# EAGLE design Beaglebone CAN Cape (EAGLE 5.12)
BOM: EXCLUDE; DESC: BBB male header; PARTNO: RC0603JR-1010KL; VERSION: v2.3.1 - 2015-05-14

## Sheet 1 of 4
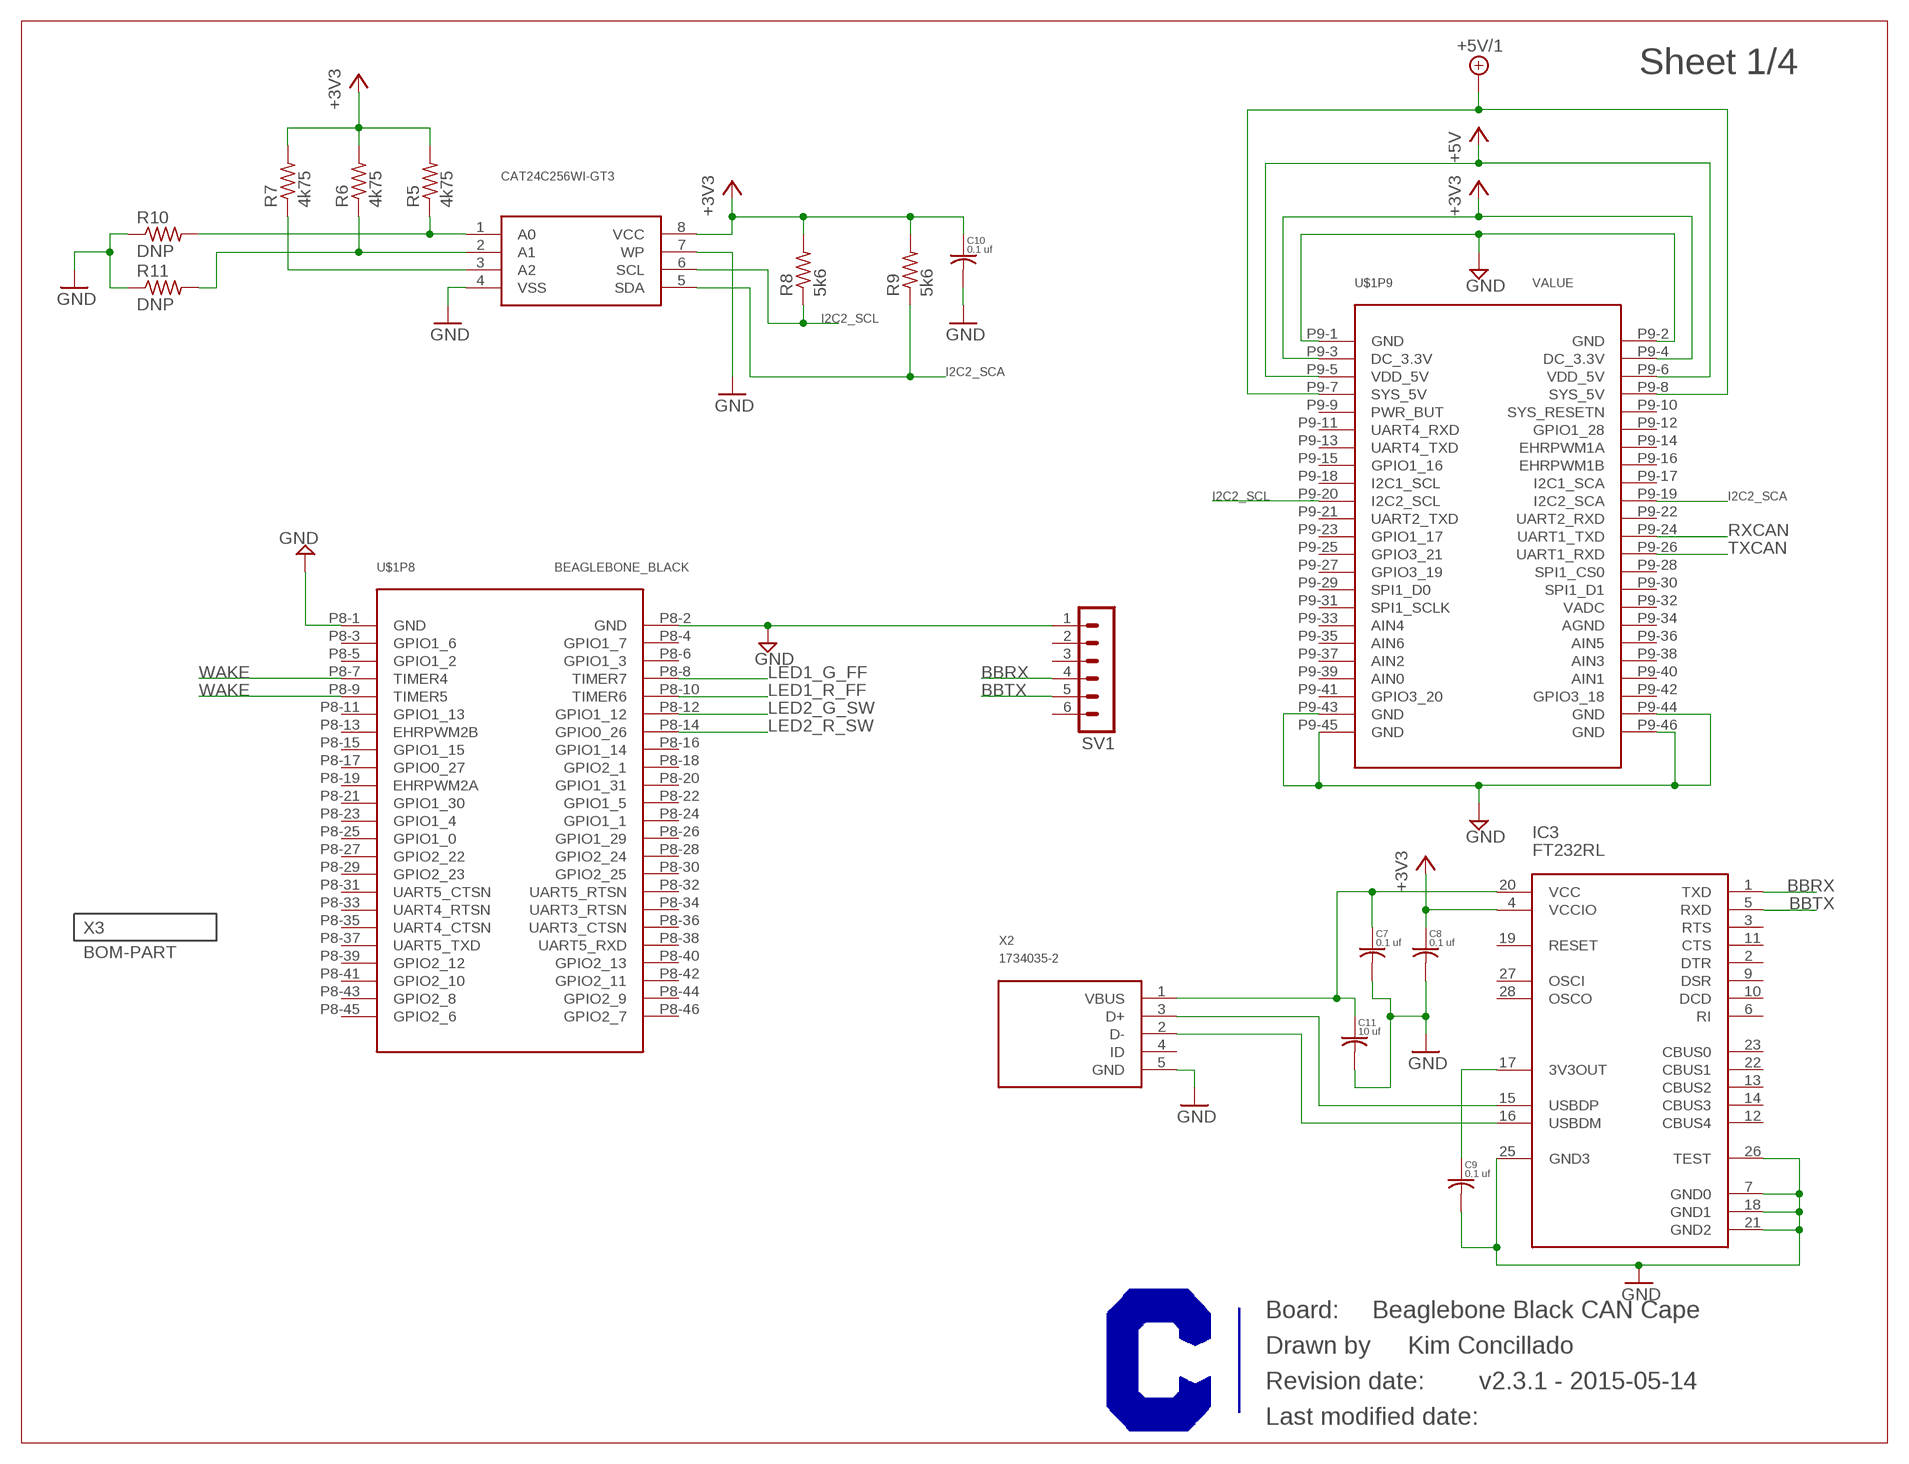
[diagram p0: schematic, sheet 1]
X3 (BOM-PART): BOM: INCLUDE; QTY: 1

### Parts
C7  0.1 uf  C-USC0603  [C0603]
C8  0.1 uf  C-USC0603  [C0603]
C9  0.1 uf  C-USC0603  [C0603]
C10  0.1 uf  C-USC0603  [C0603]
C11  10 uf  C-USC0805  [C0805]
CAT24C256WI-GT3  CAT24C256WI-GT3OSCT-ND  [CAT24C256WI-GT3]
IC3  FT232RL  [SSOP-28]
R5  4k75  R-US_R0603  [R0603]
R6  4k75  R-US_R0603  [R0603]
R7  4k75  R-US_R0603  [R0603]
R8  5k6  R-US_R0603  [R0603]
R9  5k6  R-US_R0603  [R0603]
R10  DNP  R-US_R0603  [R0603]
R11  DNP  R-US_R0603  [R0603]
SV1  MA06-1  [MA06-1]
U$1  BEAGLEBONE_BLACK  [BEAGLEBONEBLACK]
U$2  CURRENT-C-LETTER-LANDSCAPE  [BLANK]
X2  1734035-2  [1734035-2]

### Nets
+3V3: C8.1 C10.1 CAT24C256WI-GT3.8(VCC) IC3.4(VCCIO) R5.2 R6.2 R7.2 R8.2 R9.2 U$1.P9-3(P9:DC_3.3V) U$1.P9-4(P9:DC_3.3V) ; also sheet 2
+5V: U$1.P9-5(P9:VDD_5V) U$1.P9-6(P9:VDD_5V) ; also sheet 2,3
+5V/1: U$1.P9-7(P9:SYS_5V) U$1.P9-8(P9:SYS_5V)
BBRX: IC3.1(TXD) SV1.4
BBTX: IC3.5(RXD) SV1.5
GND: C7.2 C8.2 C9.2 C10.2 C11.2 CAT24C256WI-GT3.4(VSS) CAT24C256WI-GT3.7(WP) IC3.7(GND0) IC3.18(GND1) IC3.21(GND2) IC3.25(GND3) IC3.26(TEST) R10.1 R11.1 SV1.1 U$1.P8-1(P8:GND) U$1.P8-2(P8:GND) U$1.P9-1(P9:GND) U$1.P9-2(P9:GND) U$1.P9-43(P9:GND) U$1.P9-44(P9:GND) U$1.P9-45(P9:GND) U$1.P9-46(P9:GND) X2.5(GND) ; also sheet 2,3,4
I2C2_SCA: CAT24C256WI-GT3.5(SDA) R9.1 U$1.P9-19(P9:I2C2_SCA)
I2C2_SCL: CAT24C256WI-GT3.6(SCL) R8.1 U$1.P9-20(P9:I2C2_SCL)
LED1_G_FF: U$1.P8-8(P8:TIMER7) ; also sheet 4
LED1_R_FF: U$1.P8-10(P8:TIMER6) ; also sheet 4
LED2_G_SW: U$1.P8-12(P8:GPIO1_12) ; also sheet 4
LED2_R_SW: U$1.P8-14(P8:GPIO0_26) ; also sheet 4
N$11: C7.1 C11.1 IC3.20(VCC) X2.1(VBUS)
N$12: CAT24C256WI-GT3.2(A1) R6.1 R11.2
N$13: IC3.15(USBDP) X2.3(D+)
N$14: IC3.16(USBDM) X2.2(D-)
N$15: C9.1 IC3.17(3V3OUT)
N$16: CAT24C256WI-GT3.1(A0) R5.1 R10.2
N$17: CAT24C256WI-GT3.3(A2) R7.1
RXCAN: U$1.P9-24(P9:UART1_TXD) ; also sheet 3
TXCAN: U$1.P9-26(P9:UART1_RXD) ; also sheet 3
WAKE: U$1.P8-7(P8:TIMER4) U$1.P8-9(P8:TIMER5) ; also sheet 4
Unconnected: IC3.2(DTR) IC3.3(RTS) IC3.6(RI) IC3.9(DSR) IC3.10(DCD) IC3.11(CTS) IC3.12(CBUS4) IC3.13(CBUS2) IC3.14(CBUS3) IC3.19(RESET) IC3.22(CBUS1) IC3.23(CBUS0) IC3.27(OSCI) IC3.28(OSCO) SV1.2 SV1.3 SV1.6 U$1.P8-3(P8:GPIO1_6) U$1.P8-4(P8:GPIO1_7) U$1.P8-5(P8:GPIO1_2) U$1.P8-6(P8:GPIO1_3) U$1.P8-11(P8:GPIO1_13) U$1.P8-13(P8:EHRPWM2B) U$1.P8-15(P8:GPIO1_15) U$1.P8-16(P8:GPIO1_14) U$1.P8-17(P8:GPIO0_27) U$1.P8-18(P8:GPIO2_1) U$1.P8-19(P8:EHRPWM2A) U$1.P8-20(P8:GPIO1_31) U$1.P8-21(P8:GPIO1_30) U$1.P8-22(P8:GPIO1_5) U$1.P8-23(P8:GPIO1_4) U$1.P8-24(P8:GPIO1_1) U$1.P8-25(P8:GPIO1_0) U$1.P8-26(P8:GPIO1_29) U$1.P8-27(P8:GPIO2_22) U$1.P8-28(P8:GPIO2_24) U$1.P8-29(P8:GPIO2_23) U$1.P8-30(P8:GPIO2_25) U$1.P8-31(P8:UART5_CTSN) U$1.P8-32(P8:UART5_RTSN) U$1.P8-33(P8:UART4_RTSN) U$1.P8-34(P8:UART3_RTSN) U$1.P8-35(P8:UART4_CTSN) U$1.P8-36(P8:UART3_CTSN) U$1.P8-37(P8:UART5_TXD) U$1.P8-38(P8:UART5_RXD) U$1.P8-39(P8:GPIO2_12) U$1.P8-40(P8:GPIO2_13) U$1.P8-41(P8:GPIO2_10) U$1.P8-42(P8:GPIO2_11) U$1.P8-43(P8:GPIO2_8) U$1.P8-44(P8:GPIO2_9) U$1.P8-45(P8:GPIO2_6) U$1.P8-46(P8:GPIO2_7) U$1.P9-9(P9:PWR_BUT) U$1.P9-10(P9:SYS_RESETN) U$1.P9-11(P9:UART4_RXD) U$1.P9-12(P9:GPIO1_28) U$1.P9-13(P9:UART4_TXD) U$1.P9-14(P9:EHRPWM1A) U$1.P9-15(P9:GPIO1_16) U$1.P9-16(P9:EHRPWM1B) U$1.P9-17(P9:I2C1_SCA) U$1.P9-18(P9:I2C1_SCL) U$1.P9-21(P9:UART2_TXD) U$1.P9-22(P9:UART2_RXD) U$1.P9-23(P9:GPIO1_17) U$1.P9-25(P9:GPIO3_21) U$1.P9-27(P9:GPIO3_19) U$1.P9-28(P9:SPI1_CS0) U$1.P9-29(P9:SPI1_D0) U$1.P9-30(P9:SPI1_D1) U$1.P9-31(P9:SPI1_SCLK) U$1.P9-32(P9:VADC) U$1.P9-33(P9:AIN4) U$1.P9-34(P9:AGND) U$1.P9-35(P9:AIN6) U$1.P9-36(P9:AIN5) U$1.P9-37(P9:AIN2) U$1.P9-38(P9:AIN3) U$1.P9-39(P9:AIN0) U$1.P9-40(P9:AIN1) U$1.P9-41(P9:GPIO3_20) U$1.P9-42(P9:GPIO3_18) X2.4(ID)

### Notes on the sheet
- Beaglebone Black CAN Cape
- Kim Concillado

## Sheet 2 of 4
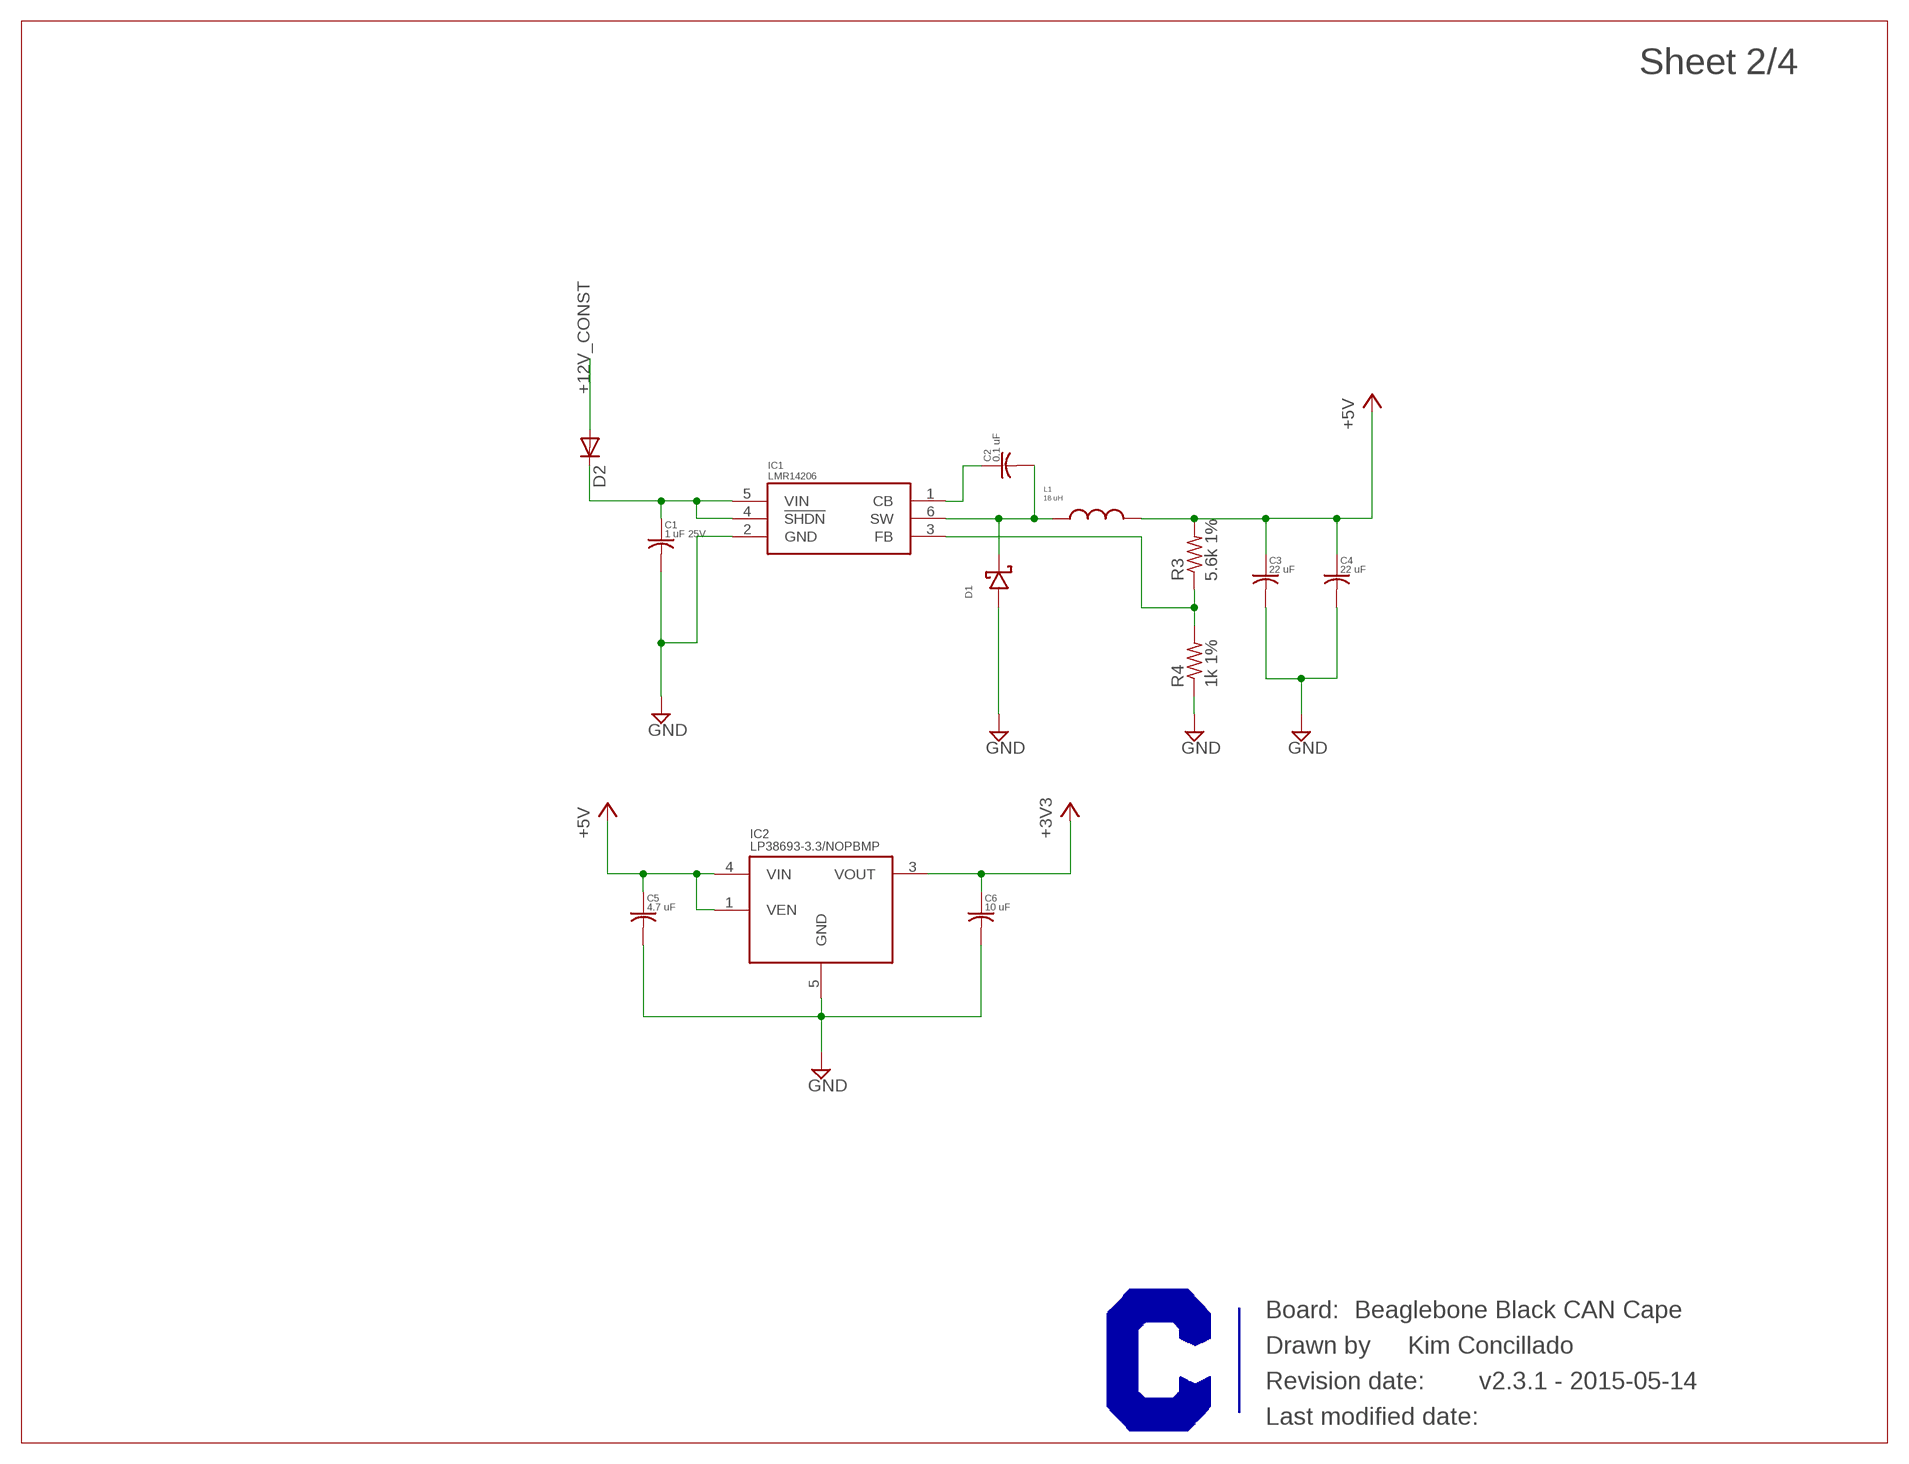
[diagram p1: schematic, sheet 2]

### Parts
C1  1 uF 25V  C-USC1206  [C1206]
C2  0.1 uF  C-USC0603  [C0603]
C3  22 uF  C-USC0805  [C0805]
C4  22 uF  C-USC0805  [C0805]
C5  4.7 uF  C-USC1206  [C1206]
C6  10 uF  C-USC1206  [C1206]
D1  SCHOTTKY_DIODE-SMA  [SMA]
D2  DIODE-SOD123  [SOD123]
IC1  LMR14206  [SOT-6_DDC]
IC2  LP38693-3.3/NOPBMP  [SOT-223-5]
L1  18 uH  VLP8040T  [VLP8040]
R3  5.6k 1%  R-US_R0603  [R0603]
R4  1k 1%  R-US_R0603  [R0603]
U$3  CURRENT-C-LETTER-LANDSCAPE  [BLANK]

### Nets
+3V3: C6.1 IC2.3(VOUT) ; also sheet 1
+5V: C3.1 C4.1 C5.1 IC2.1(VEN) IC2.4(VIN) L1.2 R3.2 ; also sheet 1,3
+12V_CONST: D2.A ; also sheet 4
GND: C1.2 C3.2 C4.2 C5.2 C6.2 D1.ANODE IC1.2(GND) IC2.5(GND) R4.1 ; also sheet 1,3,4
N$1: C1.1 D2.C IC1.4(!SHDN) IC1.5(VIN)
N$5: C2.1 IC1.1(CB)
N$6: C2.2 D1.CATHODE IC1.6(SW) L1.1
N$7: IC1.3(FB) R3.1 R4.2

### Notes on the sheet
- Beaglebone Black CAN Cape
- Kim Concillado

## Sheet 3 of 4
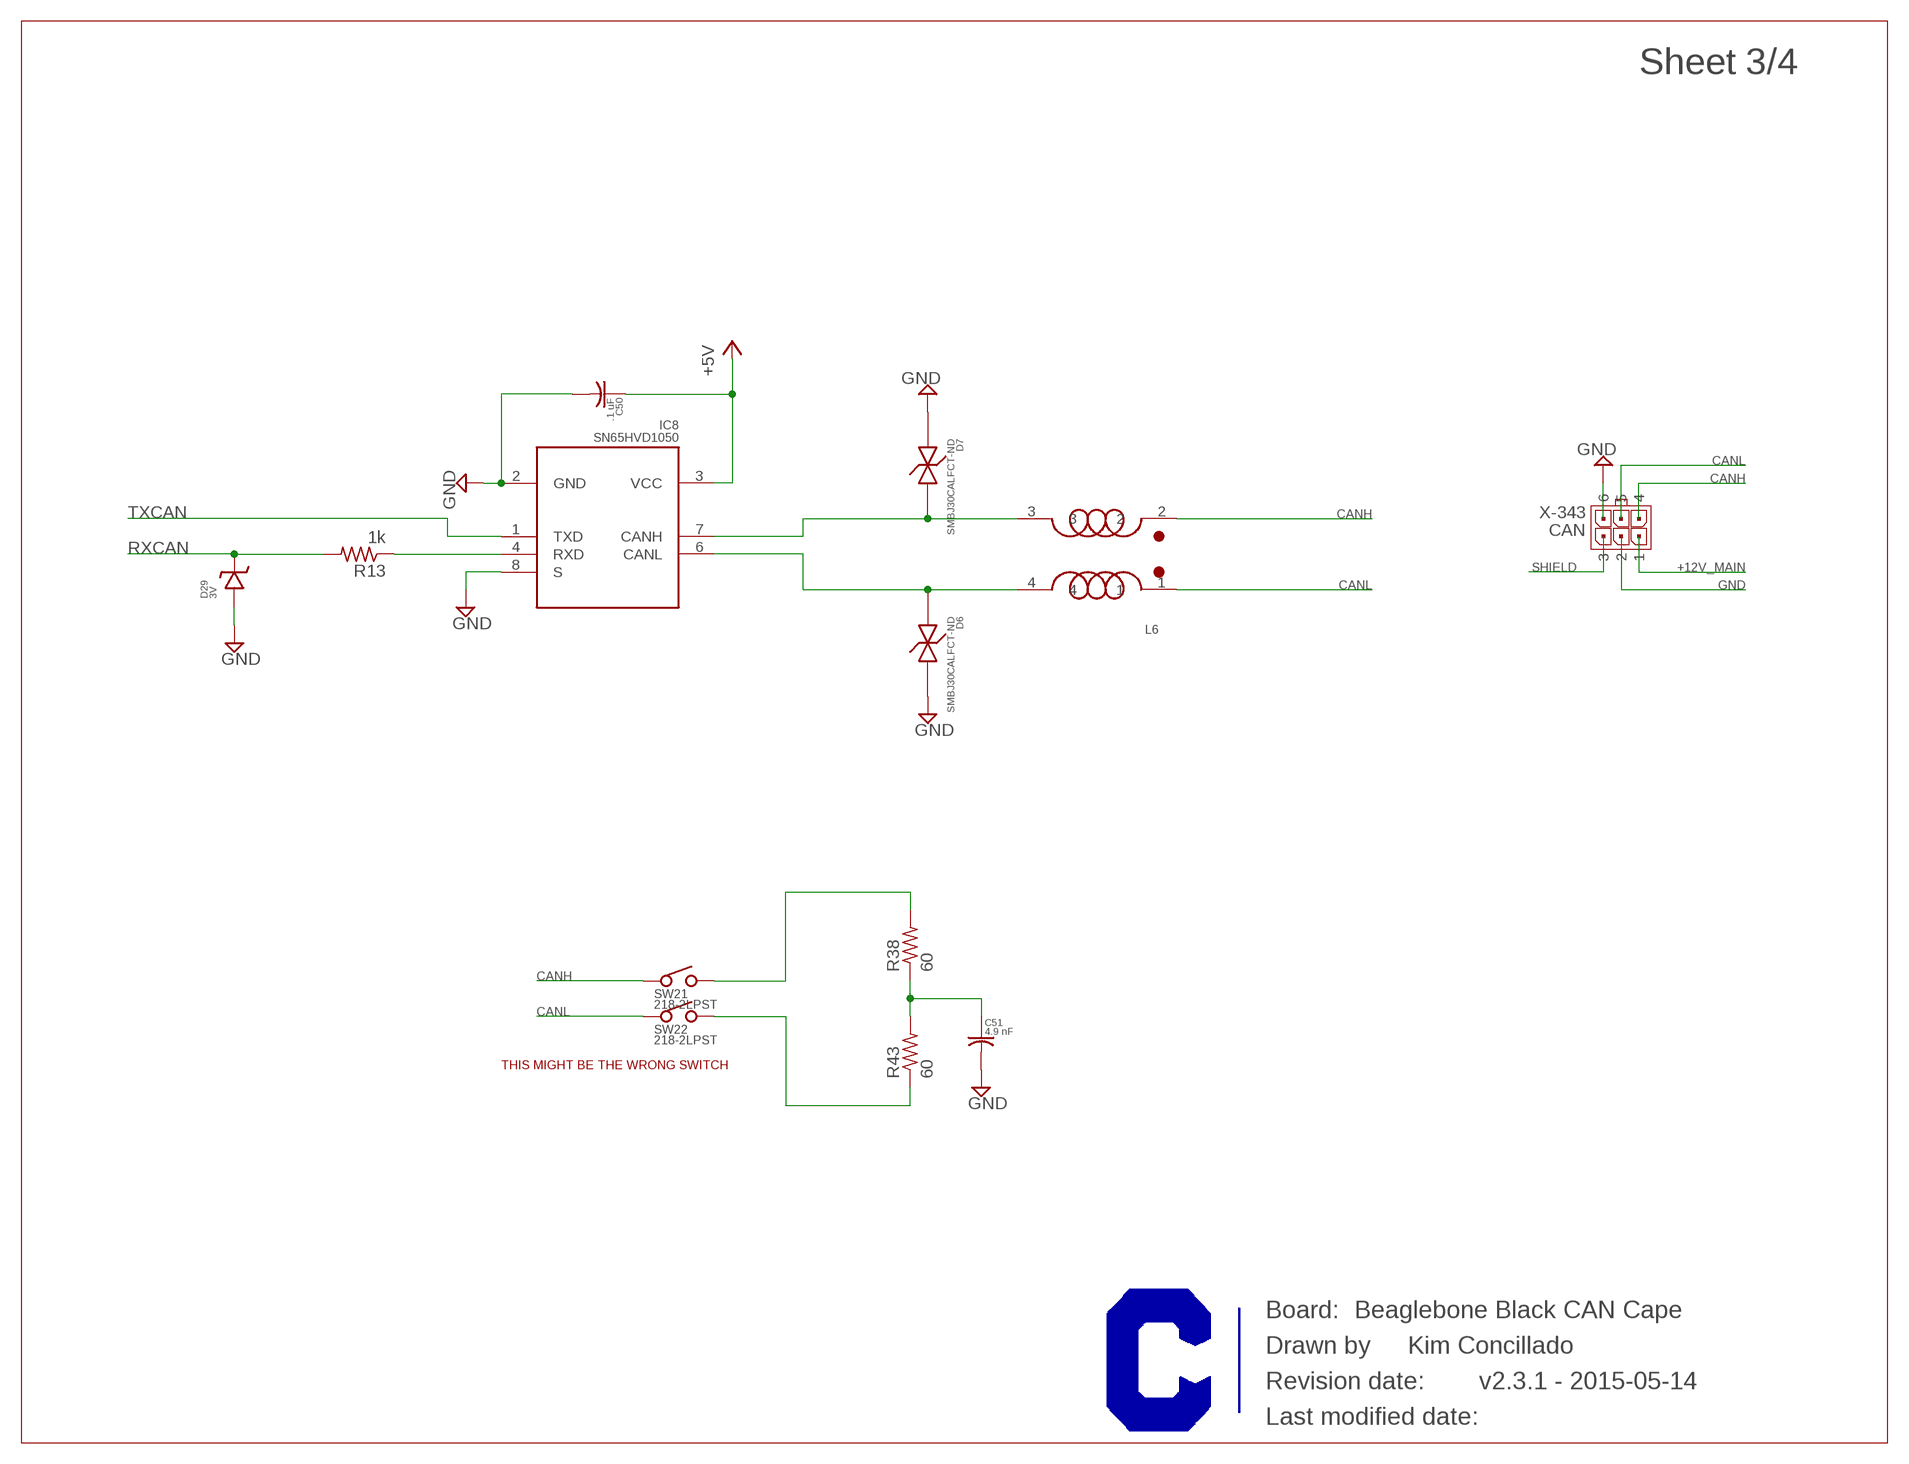
[diagram p2: schematic, sheet 3]

### Parts
C50  .1 uF  C-USC0603  [C0603]
C51  4.9 nF  C-USC0603  [C0603]
D6  SMBJ30CALFCT-ND  SMBJ30CA  [DO-214AA]
D7  SMBJ30CALFCT-ND  SMBJ30CA  [DO-214AA]
D29  3V  ZENER_DIODE-SOD-323  [SOD-323]
IC8  SN65HVD1050  [D_(R-PDSO-G8)]
L6  DR331-513AE  [SMD]
R13  1k  R-US_R0603  [R0603]
R38  60  R-US_R0603  [R0603]
R43  60  R-US_R0603  [R0603]
SW2  218-2LPST  218-2_GULLWING  [218-2_GULLWING]
U$4  CURRENT-C-LETTER-LANDSCAPE  [BLANK]
X-343  CAN  MICROFIT-06-DUAL-RA-SMD  [MICROFIT-6-DUAL-RA-SMD]

### Nets
+5V: C50.1 IC8.3(VCC) ; also sheet 1,2
+12V_MAIN: X-343.1 ; also sheet 4
CANH: L6.2 SW2.1A X-343.4
CANL: L6.1 SW2.2A X-343.5
GND: C50.2 C51.2 D6.2 D7.1 D29.ANODE IC8.2(GND) IC8.8(S) X-343.2 X-343.6 ; also sheet 1,2,4
N$19: D7.2 IC8.7(CANH) L6.3
N$22: D6.1 IC8.6(CANL) L6.4
N$39: R38.2 SW2.1B
N$40: R43.1 SW2.2B
N$41: C51.1 R38.1 R43.2
N$56: IC8.4(RXD) R13.1
RXCAN: D29.CATHODE R13.2 ; also sheet 1
SHIELD: X-343.3
TXCAN: IC8.1(TXD) ; also sheet 1

### Notes on the sheet
- SHIELD
- THIS MIGHT BE THE WRONG SWITCH
- Beaglebone Black CAN Cape
- Kim Concillado

## Sheet 4 of 4
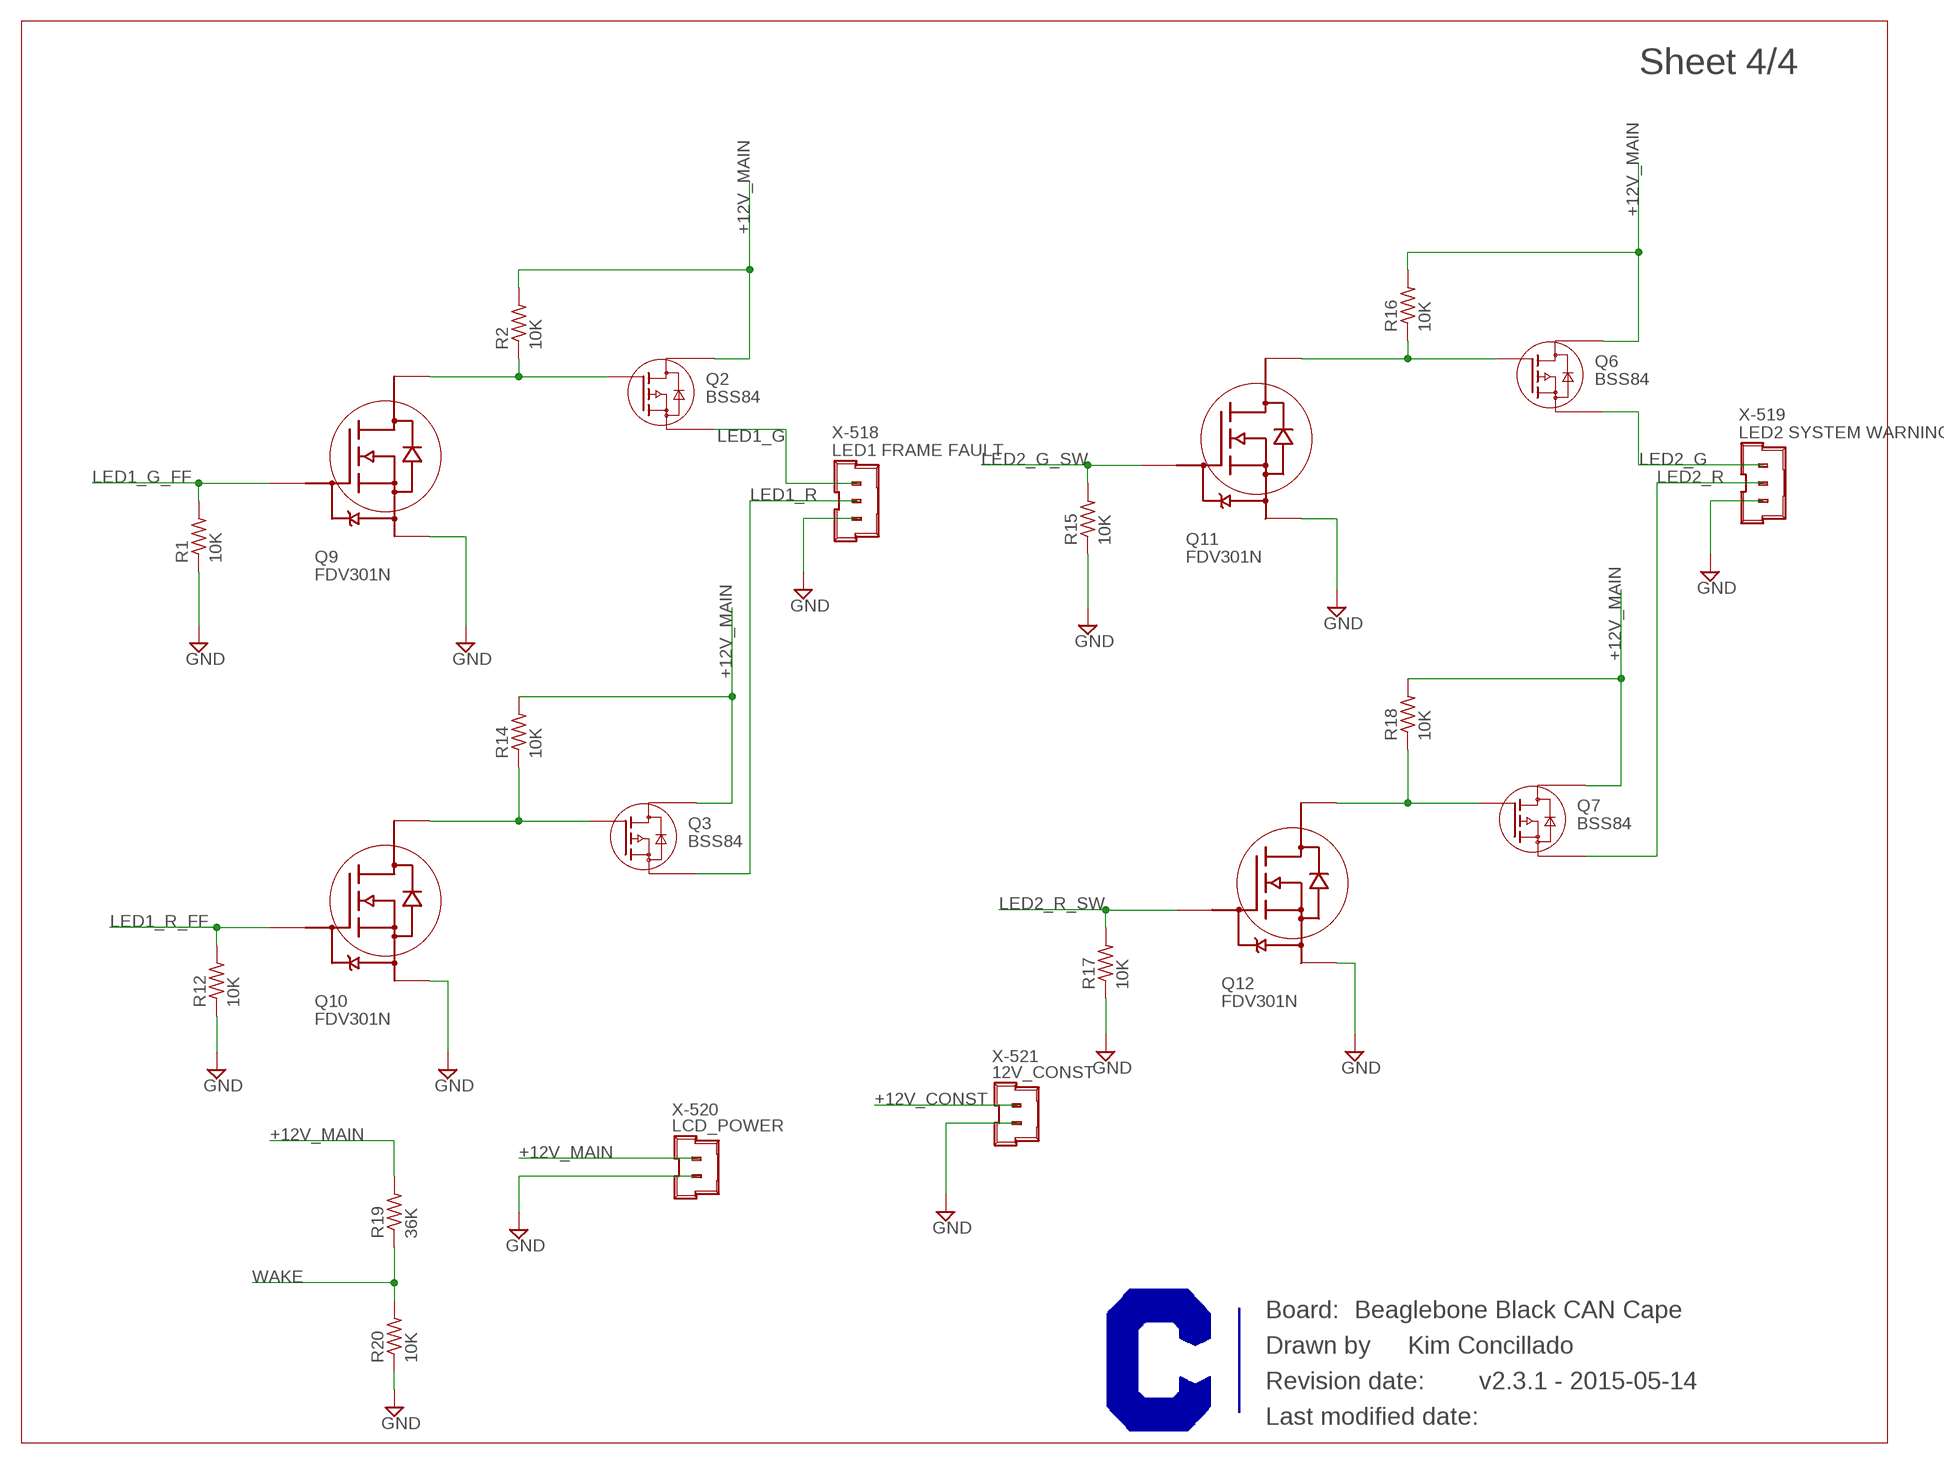
[diagram p3: schematic, sheet 4]

### Parts
Q2  BSS84  [SOT-23]
Q3  BSS84  [SOT-23]
Q6  BSS84  [SOT-23]
Q7  BSS84  [SOT-23]
Q9  FDV301N  [SOT-23]
Q10  FDV301N  [SOT-23]
Q11  FDV301N  [SOT-23]
Q12  FDV301N  [SOT-23]
R1  10K  R-US_R0603  [R0603]
R2  10K  R-US_R0603  [R0603]
R12  10K  R-US_R0603  [R0603]
R14  10K  R-US_R0603  [R0603]
R15  10K  R-US_R0603  [R0603]
R16  10K  R-US_R0603  [R0603]
R17  10K  R-US_R0603  [R0603]
R18  10K  R-US_R0603  [R0603]
R19  36K  R-US_R0603  [R0603]
R20  10K  R-US_R0603  [R0603]
U$6  CURRENT-C-LETTER-LANDSCAPE  [BLANK]
X-518  LED1 FRAME FAULT  DURACLIK-03-HDR-VERT  [DURACLIK-3-VERT]
X-519  LED2 SYSTEM WARNING  DURACLIK-03-HDR-VERT  [DURACLIK-3-VERT]
X-520  LCD_POWER  DURACLIK-02-HDR-VERT  [DURACLIK-2-VERT]
X-521  12V_CONST  DURACLIK-02-HDR-VERT  [DURACLIK-2-VERT]

### Nets
+12V_CONST: X-521.2 ; also sheet 2
+12V_MAIN: Q2.2(SOURCE) Q3.2(SOURCE) Q6.2(SOURCE) Q7.2(SOURCE) R2.2 R14.2 R16.2 R18.2 R19.2 X-520.2 ; also sheet 3
GND: Q9.2(SOURCE) Q10.2(SOURCE) Q11.2(SOURCE) Q12.2(SOURCE) R1.1 R12.1 R15.1 R17.1 R20.1 X-518.1 X-519.1 X-520.1 X-521.1 ; also sheet 1,2,3
LED1_G: Q2.3(DRAIN) X-518.3
LED1_G_FF: Q9.1(GATE) R1.2 ; also sheet 1
LED1_R: Q3.3(DRAIN) X-518.2
LED1_R_FF: Q10.1(GATE) R12.2 ; also sheet 1
LED2_G: Q6.3(DRAIN) X-519.3
LED2_G_SW: Q11.1(GATE) R15.2 ; also sheet 1
LED2_R: Q7.3(DRAIN) X-519.2
LED2_R_SW: Q12.1(GATE) R17.2 ; also sheet 1
N$4: Q2.1(GATE) Q9.3(DRAIN) R2.1
N$8: Q6.1(GATE) Q11.3(DRAIN) R16.1
N$18: Q7.1(GATE) Q12.3(DRAIN) R18.1
N$21: Q3.1(GATE) Q10.3(DRAIN) R14.1
WAKE: R19.1 R20.2 ; also sheet 1

### Notes on the sheet
- Beaglebone Black CAN Cape
- Kim Concillado

## Library data of the parts
C1-C11 C50 C51 = rcl:C-US: CAPACITOR, American symbol
CAT24C256WI-GT3 = ON Semiconductor:CAT24C256WI-GT3OSCT-ND: http://www.skyworksinc.com/uploads/documents/200123K.pdf; PARTNO: CAT24C256WI-GT3
D1 = Diodes:SCHOTTKY_DIODE
D2 = diode:DIODE-: DIODE
D6 D7 = Littelfuse:SMBJ30CA: Bidirectional TVS Zener Diode 30V Breakdown http://www.digikey.com/product-detail/en/SMBJ30CA/SMBJ30CALFCT-ND/286112; PARTNO: SMBJ30CALFCT-ND
D29 = Diodes:ZENER_DIODE
IC1 = TI:LMR14206: LMR14206 SIMPLE SWITCHER® 42Vin, 0.6A Step-Down Voltage Regulator in SOT-23 Datasheet: http://www.ti.com/lit/ds/symlink/lmr14206.pdf
IC2 = TI:LP38693: TI LP38693-3.3 LDO 500mA Very Low Vdo. http://www.ti.com/lit/ds/symlink/lp38693.pdf; PARTNO: LP38693MP-3.3/NOPB
IC3 = FTDI:FT232RL: http://datasheet.octopart.com/FT232RL-FTDI-datasheet-120501.pdf; PARTNO: FT232RL
IC8 = TI:SN65HVD1050: SN65HVD1050 - EMC Optimized CAN Transceiever Datasheet: http://www.ti.com/lit/ds/symlink/sn65hvd1050.pdf; PARTNO: SN65HVD1050D
L1 = TDK:VLP: VLP Series Shielded Wound Ferrite Inductors Datasheet: http://datasheet.octopart.com/VLP8040T-100M-TDK-datasheet-16646286.pdf
L6 = Bourns:DR331-513AE: Bourns Common Mode Choke; PARTNO: DR331-513AECT-ND
Q2 Q3 Q6 Q7 = Fairchild Semiconductor:BSS84: P-Channel Enhancement Mode Field-Effect Transistor, -0.13 A, -50 V, SOT-23 Datasheet: http://datasheet.octopart.com/BSS84-Fairchild-Semiconductor-datasheet-15983362.pdf; PARTNO: BSS84
Q9-Q12 = Fairchild Semiconductor:FDV301N: FDV301N: Digital FET, N-Channel, 25V, 0.22 A continuous Datasheet: http://www.fairchildsemi.com/ds/FD/FDV301N.pdf; PARTNO: FDV301N
R1-R20 R38 R43 = rcl:R-US_: RESISTOR, American symbol
SV1 = con-lstb:MA06-1: PIN HEADER; OC_FARNELL: unknown; OC_NEWARK: unknown
SW2 = CTS:218-2: CTS 218-2: 0.05" pitch DIP switch, SPST, 2 positions; PARTNO: 218-2LPST
U$1 = TI:BEAGLEBONE_BLACK
U$2-U$4 U$6 = Frames:CURRENT-C-LETTER-LANDSCAPE; BOM: EXCLUDE
X2 = TE:1734035-2: http://datasheet.octopart.com/1734035-2-TE-Connectivity-datasheet-11087025.pdf; PARTNO: 1734035-2
X-343 = Molex:MICROFIT-06-DUAL: Molex MicroFit 3.00mm Pitch Header, Surface Mount, Dual Row, 6 Circuits Note, November 2014: These come in three styles: Through-hole, with metal clip retention to PCB (not currently represented) (cheapest) SMD, with solder tab retention (-SMD) (more expensive, commonly stocked) SMD, with metal clip retention (-SMD-CLIP_RETENTION) (most expensive, not often stocked) Please use them in that order! Drawing: http://www.molex.com/pdm_docs/sd/430450609_sd.pdf (right-angle) Information: http://www.molex.com/molex/products/datasheet.jsp?part=active/0430450618_PCB_HEADERS.xml; PARTNO: 43045-0609
X-518 X-519 = Molex:DURACLIK-03-HDR: Dura-Clik Wire-to-Board Header, Single Row, 3 Circuits Vertical version: Product page: http://www.molex.com/molex/products/datasheet.jsp?part=active/5600200320_PCB_HEADERS.xml Drawing: http://www.molex.com/pdm_docs/sd/5600200320_sd.pdf; PARTNO: 560020-0320
X-520 X-521 = Molex:DURACLIK-02-HDR: Dura-Clik Wire-to-Board Header, Single Row, 2 Circuits Right-angle version: Product page: http://www.molex.com/molex/products/datasheet.jsp?part=active/5023520200_PCB_HEADERS.xml Drawing: http://www.molex.com/pdm_docs/sd/5023520200_sd.pdf Vertical version: Product page: http://www.molex.com/molex/products/datasheet.jsp?part=active/5600200220_PCB_HEADERS.xml Drawing: http://www.molex.com/pdm_docs/sd/5600200220_sd.pdf; PARTNO: 560020-0220

## Board
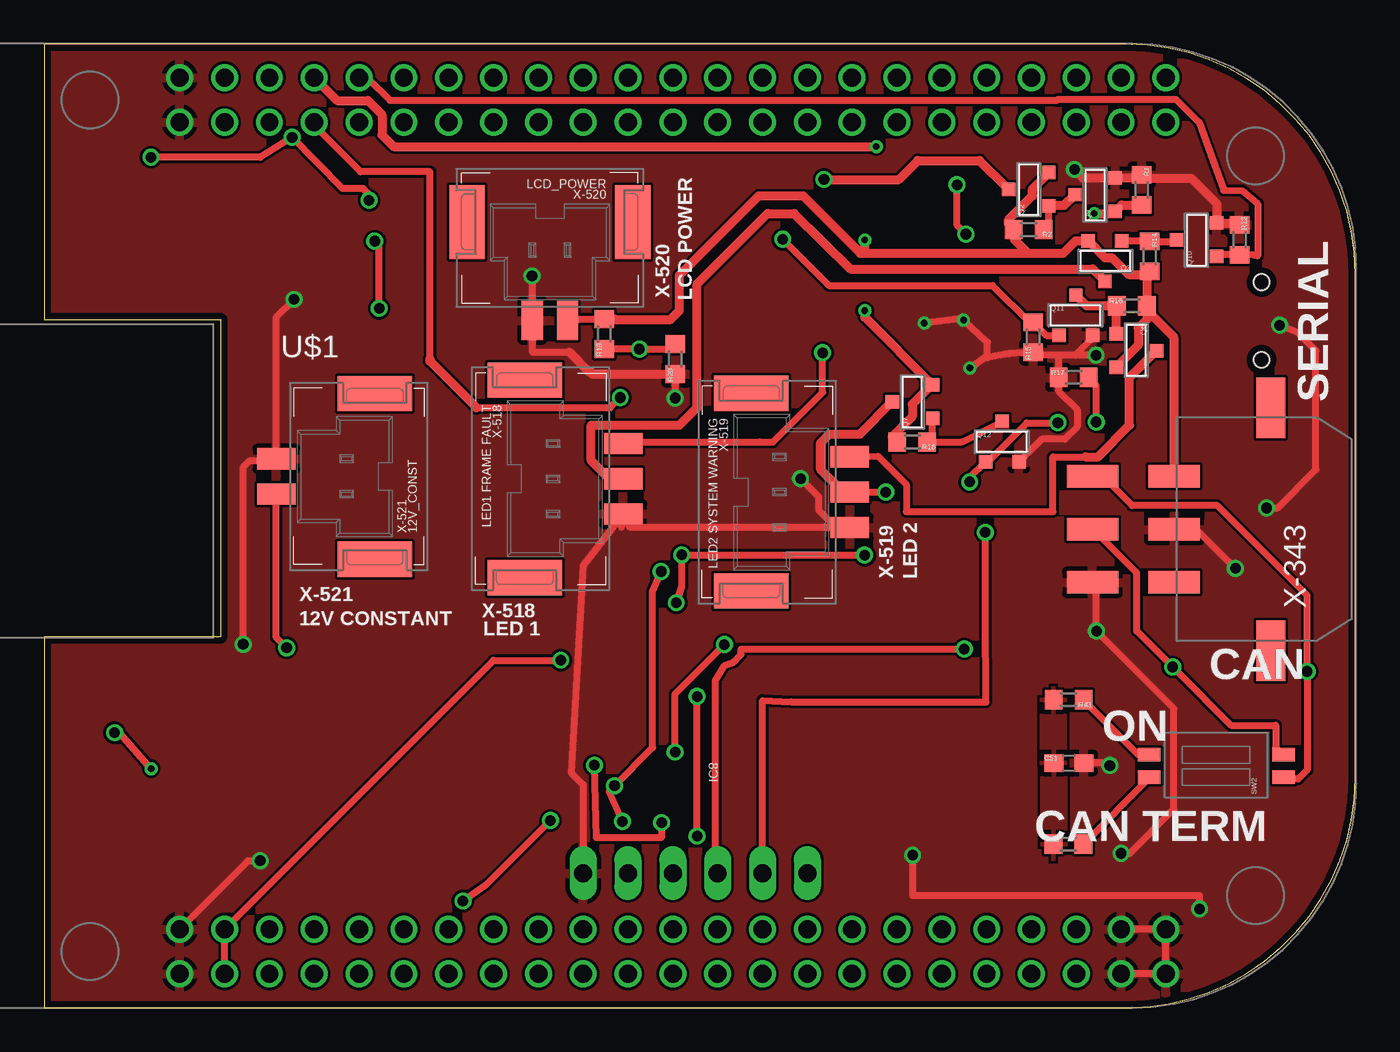
[diagram p4: board, top side]
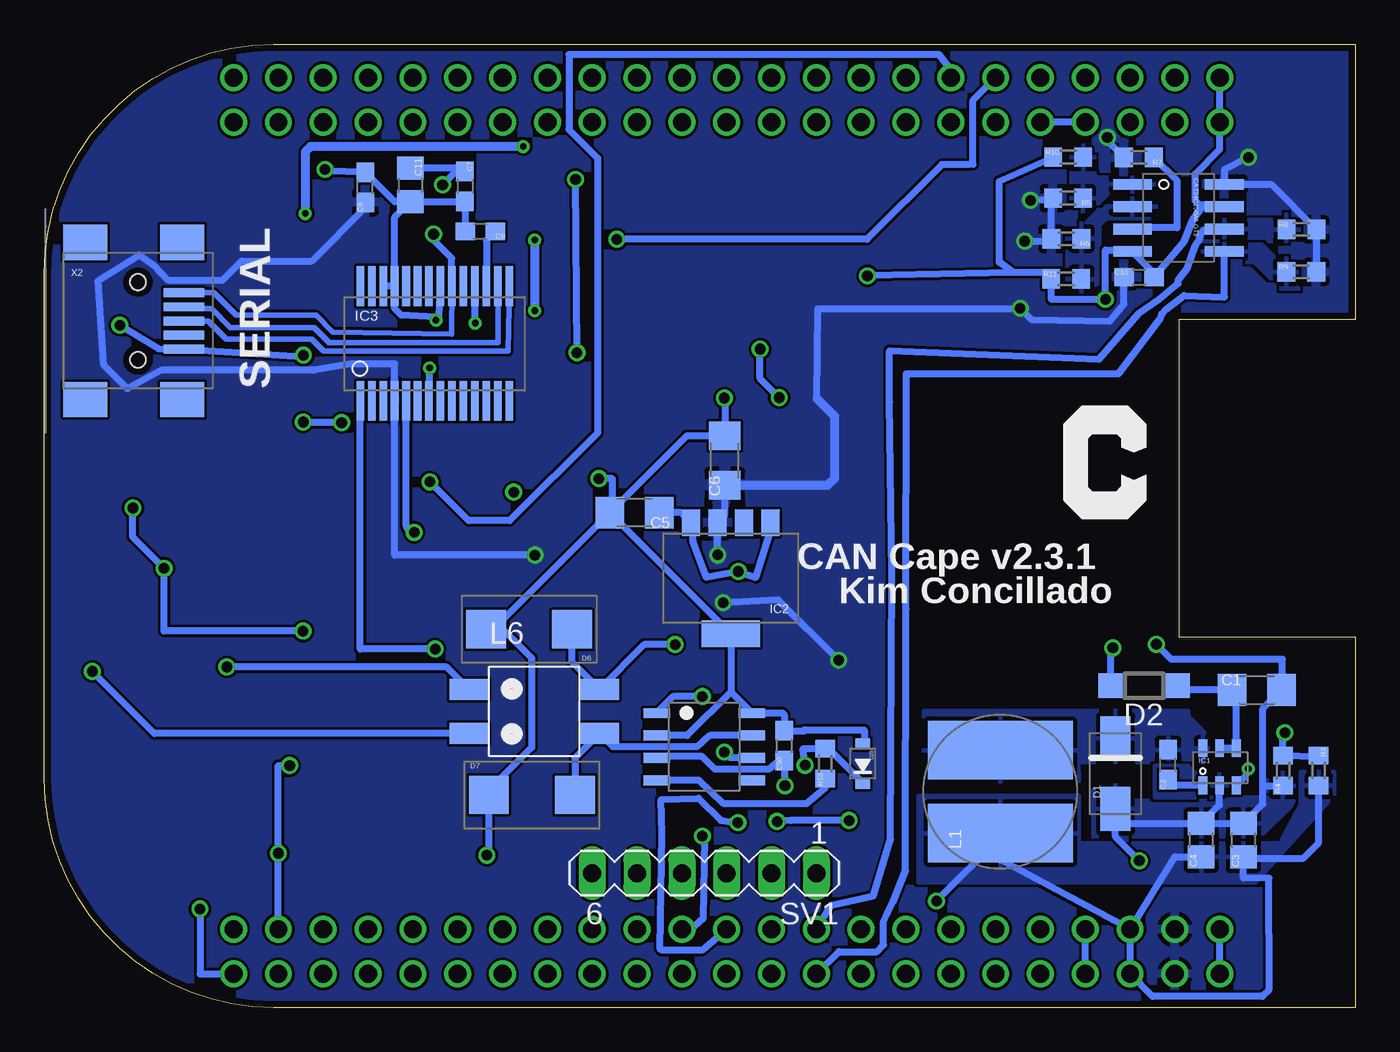
[diagram p5: board, bottom side, seen from below]

Size 74.3 x 54.6 mm. Coordinates in mm from the lower left corner, seen from the top.
Outline: 0,0 61.3,0 arc90 74.3,13 74.3,41.6 arc90 61.3,54.6 0,54.6 0,39 10,39 10,21 0,21 0,0
Copper layers (1*16): Top 0.0356mm / dielectric 1.5011mm / Bottom 0.0356mm
Design rules "OSH Park 2-layer": minimum track width 6mil, minimum drill 13mil, track to track 6mil, track to pad 6mil, pad to pad 6mil, via to via 6mil, smd to smd 6mil, copper to edge 15mil, drill to drill 6mil, minimum pad ring 7mil, minimum via ring 7mil, stop-mask expansion 4mil, vias tented up to drill 25mil, thermal gap 10mil

### Footprints (pad centres in the part's own frame; a part is rotated, then mirrored left to right if it is on the bottom)
C1206 = smd 1.6 x 1.8: 1 -1.4,0; 2 1.4,0
C0603 = smd 1.1 x 1: 1 -0.85,0; 2 0.85,0
C0805 = smd 1.3 x 1.5: 1 -0.95,0; 2 0.95,0
CAT24C256WI-GT3 = smd 2.2 x 0.6: 1 -2.6,1.905; 2 -2.6,0.635; 3 -2.6,-0.635; 4 -2.6,-1.905; 5 2.6,-1.905; 6 2.6,-0.635; 7 2.6,0.635; 8 2.6,1.905
SMA = smd 2.5 x 1.7: ANODE -2,0; CATHODE 2,0
SOD123 = smd 1.4 x 1.4: A 1.9,0; C -1.9,0
DO-214AA = smd 2.261 x 2.159: 1 -2.438,0; 2 2.438,0
SOD-323 = smd 0.63 x 0.83: ANODE -1.115,0; CATHODE 1.115,0
SOT-6_DDC = smd 0.5 x 1: 1 -0.95,-1.05; 2 0,-1.05; 3 0.95,-1.05; 4 0.95,1.05; 5 0,1.05; 6 -0.95,1.05
SOT-223-5 = smd 1 x 1.5: 1 -2.25,-3.15; 2 -0.75,-3.15; 3 0.75,-3.15; 4 2.25,-3.15 | smd 3.3 x 1.5: 5 0,3.15
SSOP-28 = smd 0.43 x 2.25: 1 -4.225,-3.225; 2 -3.575,-3.225; 3 -2.925,-3.225; 4 -2.275,-3.225; 5 -1.625,-3.225; 6 -0.975,-3.225; 7 -0.325,-3.225; 8 0.325,-3.225; 9 0.975,-3.225; 10 1.625,-3.225; 11 2.275,-3.225; 12 2.925,-3.225; 13 3.575,-3.225; 14 4.225,-3.225; 15 4.225,3.275; 16 3.575,3.275; 17 2.925,3.275; 18 2.275,3.275; 19 1.625,3.275; 20 0.975,3.275; 21 0.325,3.275; 22 -0.325,3.275; 23 -0.975,3.275; 24 -1.625,3.275; 25 -2.275,3.275; 26 -2.925,3.275; 27 -3.575,3.275; 28 -4.225,3.275
D_(R-PDSO-G8) = smd 1.5 x 0.55: 1 -2.7,1.905; 2 -2.7,0.635; 3 -2.7,-0.635; 4 -2.7,-1.905; 5 2.7,-1.905; 6 2.7,-0.635; 7 2.7,0.635; 8 2.7,1.905
VLP8040 = smd 3.3 x 8.2: 1 2.35,0; 2 -2.35,0
SMD = smd 2.21 x 1.2: 1 -3.7,1.25; 2 -3.7,-1.25; 3 3.7,-1.25; 4 3.7,1.25
SOT-23 = smd 0.76 x 0.76: 1 -0.95,-1.145; 2 0.95,-1.145; 3 0,1.145
R0603 = smd 1 x 1.1: 1 -0.85,0; 2 0.85,0
MA06-1 = drill 1.016 long: 1 -6.35,0; 2 -3.81,0; 3 -1.27,0; 4 1.27,0; 5 3.81,0; 6 6.35,0
218-2_GULLWING = smd 0.76 x 1.27: 1A -0.635,-3.81; 1B -0.635,3.81; 2A 0.635,-3.81; 2B 0.635,3.81
BEAGLEBONEBLACK = drill 1.016 round: P8-1 19.685,50.165; P8-2 19.685,52.705; P8-3 22.225,50.165; P8-4 22.225,52.705; P8-5 24.765,50.165; P8-6 24.765,52.705; P8-7 27.305,50.165; P8-8 27.305,52.705; P8-9 29.845,50.165; P8-10 29.845,52.705; P8-11 32.385,50.165; P8-12 32.385,52.705; P8-13 34.925,50.165; P8-14 34.925,52.705; P8-15 37.465,50.165; P8-16 37.465,52.705; P8-17 40.005,50.165; P8-18 40.005,52.705; P8-19 42.545,50.165; P8-20 42.545,52.705; P8-21 45.085,50.165; P8-22 45.085,52.705; P8-23 47.625,50.165; P8-24 47.625,52.705; P8-25 50.165,50.165; P8-26 50.165,52.705; P8-27 52.705,50.165; P8-28 52.705,52.705; P8-29 55.245,50.165; P8-30 55.245,52.705; P8-31 57.785,50.165; P8-32 57.785,52.705; P8-33 60.325,50.165; P8-34 60.325,52.705; P8-35 62.865,50.165; P8-36 62.865,52.705; P8-37 65.405,50.165; P8-38 65.405,52.705; P8-39 67.945,50.165; P8-40 67.945,52.705; P8-41 70.485,50.165; P8-42 70.485,52.705; P8-43 73.025,50.165; P8-44 73.025,52.705; P8-45 75.565,50.165; P8-46 75.565,52.705; P9-1 19.685,1.905; P9-2 19.685,4.445; P9-3 22.225,1.905; P9-4 22.225,4.445; P9-5 24.765,1.905; P9-6 24.765,4.445; P9-7 27.305,1.905; P9-8 27.305,4.445; P9-9 29.845,1.905; P9-10 29.845,4.445; P9-11 32.385,1.905; P9-12 32.385,4.445; P9-13 34.925,1.905; P9-14 34.925,4.445; P9-15 37.465,1.905; P9-16 37.465,4.445; P9-17 40.005,1.905; P9-18 40.005,4.445; P9-19 42.545,1.905; P9-20 42.545,4.445; P9-21 45.085,1.905; P9-22 45.085,4.445; P9-23 47.625,1.905; P9-24 47.625,4.445; P9-25 50.165,1.905; P9-26 50.165,4.445; P9-27 52.705,1.905; P9-28 52.705,4.445; P9-29 55.245,1.905; P9-30 55.245,4.445; P9-31 57.785,1.905; P9-32 57.785,4.445; P9-33 60.325,1.905; P9-34 60.325,4.445; P9-35 62.865,1.905; P9-36 62.865,4.445; P9-37 65.405,1.905; P9-38 65.405,4.445; P9-39 67.945,1.905; P9-40 67.945,4.445; P9-41 70.485,1.905; P9-42 70.485,4.445; P9-43 73.025,1.905; P9-44 73.025,4.445; P9-45 75.565,1.905; P9-46 75.565,4.445
1734035-2 = smd 2.3 x 0.5: 1 2.6,1.6; 2 2.6,0.8; 3 2.6,0; 4 2.6,-0.8; 5 2.6,-1.6 | smd 2.5 x 2: P$1 -3,-4.45; P$2 -3,4.45; P$3 2.5,4.45; P$4 2.5,-4.45 | hole 0.9: 0,2.2; 0,-2.2
MICROFIT-6-DUAL-RA-SMD = smd 1.27 x 2.921: 1 3,5.47; 2 0,5.47; 3 -3,5.47; 4 3,10.1; 5 0,10.1; 6 -3,10.1 | smd 3.429 x 1.651: P$9 6.883,0; P$10 -6.883,0
DURACLIK-3-VERT = smd 1.2 x 2.2: 1 2,5.58; 2 0,5.58; 3 -2,5.58 | smd 2 x 4.2: 4 5.6,0; 5 -5.6,0
DURACLIK-2-VERT = smd 1.2 x 2.2: 1 1,5.58; 2 -1,5.58 | smd 2 x 4.2: 4 4.7,0; 5 -4.7,0

### Placement (x,y rotation side)
C1  5.59,18 0 bottom
C2  10.61,13.77 90 bottom
C3  6.34,9.49 90 bottom
C4  8.73,9.5 90 bottom
C5  40.84,28.05 180 bottom
C6  35.73,31 90 bottom
C7  50.45,46.54 270 bottom
C8  56.1,46.48 90 bottom
C9  49.59,43.98 180 bottom
C10  12.26,41.39 0 bottom
C11  53.55,46.62 270 bottom
C50  32.35,14.84 90 bottom
C51  58.06,13.86 0 top
CAT24C256WI-GT3  10.03,44.75 0 bottom
D1  13.6,13.26 90 bottom
D2  11.97,18.25 180 bottom
D6  46.81,21.45 180 bottom
D7  46.66,12.05 0 bottom
D29  27.92,13.84 270 bottom
IC1  7.7,13.65 0 bottom
IC2  35.39,24.34 180 bottom
IC3  52.16,37.61 0 bottom
IC8  36.89,14.79 0 bottom
L1  20.12,12.24 90 bottom
L6  46.53,16.79 0 bottom
Q2  55.79,46.37 90 top
Q3  60.11,42.31 180 top
Q6  61.88,37.23 270 top
Q7  49.19,34.34 90 top
Q9  59.55,46.07 90 top
Q10  65.3,43.51 90 top
Q11  58.46,39.23 0 top
Q12  54.29,32.07 0 top
R1  62.19,46.33 270 top
R2  55.79,44.09 180 top
R3  2.08,13.44 270 bottom
R4  4.11,13.43 90 bottom
R5  16.29,45.87 180 bottom
R6  16.38,43.57 180 bottom
R7  12.27,48.17 180 bottom
R8  3.06,44.09 0 bottom
R9  3.07,41.69 0 bottom
R10  16.28,48.19 0 bottom
R11  16.39,41.29 0 bottom
R12  67.73,43.51 270 top
R13  30.04,13.83 90 bottom
R14  62.65,42.56 270 top
R15  56.04,37.99 90 top
R16  61.63,39.77 0 top
R17  58.33,35.71 0 top
R18  49.19,32.05 180 top
R19  31.73,38.17 90 top
R20  35.77,36.75 90 top
R38  58.03,9.26 0 top
R43  58.04,17.44 180 top
SV1  36.9,7.62 180 bottom
SW2  66.41,13.69 90 top
U$1  -12,0 0 top
U$2  -13,-2 0 top  (outside the outline)
U$3  -14,-4 0 top  (outside the outline)
U$4  -15,-6 0 top  (outside the outline)
U$5  [CURRENT-0.25"]  16.51,27.78 0 bottom
U$6  -15.81,-7.11 0 top  (outside the outline)
X2  68.97,38.91 0 bottom
X-343  69.5,27.1 90 top
X-518  27.23,29.96 270 top
X-519  40.07,29.21 270 top
X-520  28.66,44.52 180 top
X-521  18.74,30.1 90 top

### Tracks (layer width: path | path; a pad name or v marks a point on that pad's centre or on a via)
+3V3  (via drill 0.6)
  Top 0.406: U$1.P9-3 U$1.P9-4 25.47,19.68 v29.27,19.68 | v35.82,22.94 36.13,23.88 v36.13,25.65 46.49,25.65 v46.49,25.64 | v6.05,48.19 12.25,48.19 v14.05,49.32 16.9,46.41 18.08,46.41 18.41,46.08 v18.41,45.75 | v18.99,39.62 18.99,43.43 v18.73,43.43
  Bottom 0.406: R9.2 R8.2 4.77,46.66 CAT24C256WI-GT3.8 7.43,47.49 v6.05,48.19 | v29.27,19.68 32.7,23.11 v35.82,22.94 | v36.13,25.65 36.14,25.66 IC2.3 35.73,27.9 C6.1 35.73,29.99 | v14.05,49.32 14.04,49.09 R7.2 | 30.5,34.5 30.46,39.61 v18.99,39.62 18.35,38.99 13.91,38.9 13.12,39.88 C10.1 | v18.73,43.43 17.36,43.43 R6.2 17.23,45.78 R5.2 17.26,45.75 v18.41,45.75 | C8.1 56.1,45.33 59.12,42.31 63.1,42.31 64.18,41.23 67.3,41.23 68.11,42.07 68.92,42.66 71.24,41.19 70.91,36.41 69.84,35.34 69.56,35.08 67.65,36.12 59.01,36.12 56.95,36.47 54.44,36.47 | 54.44,36.47 54.44,36.49 | 54.44,36.47 54.44,34.48 IC3.4 54.44,25.64 v46.49,25.64
  Bottom 0.5: 30.5,34.5 29.5,33.5 29.5,30 29.9,29.6 C6.1
  pour Bottom (rank 6): -5,54.5 -5,39 10,39 10,21 -12,21 -12,5.5 arc90 -6.5,0 63,0 63.5,0 arc90 74.5,11 74.5,41.5 arc90 61.5,54.5
  pour Bottom: 34.84,28.84 37.88,28.84 37.88,30.37 34.84,30.37
+5V  (via drill 0.6)
  Top 0.406: v34.96,24.71 34.48,23.62 34.48,14.73 v32.32,12.57 32.01,12.26 v32.77,10.55 | v23.73,6.04 25.07,6.98 v28.69,10.6
  Bottom 0.406: U$1.P9-6 U$1.P9-5 11.5,0.64 5.27,0.64 4.89,1.02 4.9,7.34 6.34,7.35 C3.1 6.27,8.47 2.95,8.47 2.08,9.34 R3.2 | C5.1 38.2,28.05 IC2.4 37.53,27.37 37.53,26.42 36.77,24.38 v34.96,24.71 33.97,24.38 33.14,26.99 IC2.1 | IC8.3 39.52,14.22 37.02,14.22 36.3,13.51 33.24,13.51 32.69,13.99 C50.1 32.32,13.96 v32.32,12.57 | U$1.P9-6 20.12,8.36 L1.2 20.12,9.65 v23.73,6.04 | U$1.P9-6 10.22,8.55 C4.1 | v28.69,10.6 32,10.6 v32.77,10.55
  pour Bottom (rank 2): 24.76,11.99 15.66,11.99 15.66,9.41 15.76,9.31 4.24,9.31 3.08,11.49 3.08,13.35 1.19,13.35 1.19,12.06 5.66,7.11 24.76,7.11
+5V/1
  Bottom 0.406: U$1.P9-7 U$1.P9-8
+12V_CONST  (via drill 0.6)
  Top 0.406: v13.74,20.39 13.16,20.97 X-521.2
  Bottom 0.406: D2.A 13.87,20.26 v13.74,20.39
+12V_MAIN  (via drill 0.38)
  Top 0.406: 54.64,44.38 R2.2 54.98,44.05 | 62.48,41.55 R14.2 | 48.05,32.34 R18.2 | 32.31,39.02 R19.2 29.66,39.02 X-520.2
  Top 0.5: 55.75,42.75 55,43.5 55,44.03 R2.2 | 54.64,44.38 54.64,44.64 56,46 56,46.39 Q2.2 | R16.2 62.48,41.55 61.45,41.55 60.5,42.5 60.11,42.5 Q3.2 58.45,43.45 57.75,42.75 55.75,42.75 | Q6.2 62,37.54 62,38.5 62.48,38.98 R16.2 | X-343.1 64,30.13 64,38 62.48,39.52 R16.2 | 32.31,39.02 32.33,39 35.5,39 36,39.5 36,41.5 40.5,46 43,46 46.25,42.75 46.5,42.75 | 46.5,42.75 55.75,42.75 | 48.05,32.34 49.2,33.5 49.2,34.2 50.29,35.29 Q7.2 46.5,39.12 v46.5,39.5 | 46.5,42.75 v46.5,43.5
  Bottom 0.5: v46.5,43.5 v46.5,39.5
BBRX  (via drill 0.6)
  Top 0.406: SV1.4 38.04,7.75 38.04,18.54 38.55,19.38 39.08,19.6 39.5,20.02 39.5,20.32 v52.14,20.32
  Bottom 0.406: v52.14,20.32 56.39,20.32 IC3.1
BBTX  (via drill 0.6)
  Top 0.406: SV1.5 40.7,17.4 42.33,17.33 53.37,17.32 53.33,22.36 v53.33,26.93
  Bottom 0.406: v53.33,26.93 arc90 53.79,27.39 IC3.5
CANH  (via drill 0.6)
  Top 0.406: X-343.4 60.01,30.1 61.66,28.45 66.49,28.45 71.57,23.37 v71.57,19.05 71.57,13.46 71.06,12.95 70.32,12.95 SW2.1A
  Bottom 0.406: L6.2 68.05,15.54 v71.57,19.05
CANL  (via drill 0.6)
  Top 0.406: X-343.5 59.45,27.1 61.91,24.64 61.91,21.34 v63.95,19.3 64.2,19.05 67.25,16 69.79,16 69.79,14.76 SW2.2A
  Bottom 0.406: L6.1 51.5,19.3 v63.95,19.3
GND  (via drill 0.38, 0.6)
  Top 0.406: X-518.1 33.2,27.21 X-519.1 44.86,27.21 43.88,28.19 43.88,28.96 v42.86,29.97 | X-518.1 30.55,25.06 29.87,13.31 30.55,12.63 SV1.1 | X-518.1 32.7,27.21 | U$1.P9-43 U$1.P9-45 U$1.P9-46 U$1.P9-44 | C51.2 60.39,13.86 v60.39,13.72 | v65.47,5.59 65.47,6.35 49.21,6.35 v49.21,8.64 | X-343.6 59.63,24.1 v59.63,21.34 64.02,16.94 64.02,11.25 61.51,8.74 v61.03,8.74 | v67.5,24.89 65.29,27.1 X-343.2 | v27.65,41.47 27.66,41.45 X-520.1 27.66,37.16 27.68,37.14 29.77,37.14 | 35.75,34.55 v35.75,34.54 35.75,35.88 R20.1 | v12.24,8.32 11.56,8.32 U$1.P9-2 | v11.28,20.59 11.28,30.63 11.65,31 13.06,31 X-521.1 13.16,39.13 v14.16,40.13 | v70.01,38.67 71.02,38.27 72.07,37.22 72.07,30.49 69.9,28.32 v69.28,28.32 v69.27,28.31 | v59.61,36.97 58.44,36.97 | 58.44,36.97 57.48,36.97 | 57.48,36.97 R17.1 57.48,34.94 58.54,33.88 58.54,32.91 57.84,32.21 56.53,32.21 Q12.2 | 57.48,36.97 56.04,36.97 R15.1 54.67,37.06 53.45,36.82 53.31,36.82 v52.45,36.25 53.4,36.91 53.45,36.91 53.45,37.69 v52.1,38.96 52.02,39.03 v49.87,38.78 | Q11.2 59.41,37.94 58.44,36.97
  Top 0.5: R12.1 67.63,44.46 Q10.2 66.44,45.55 65,47 62.37,47 R1.1 62.03,47.02 Q9.2 58.86,47.02 v58.38,47.5 | 29.77,37.14 30.91,36 31,36 31.1,35.9 R20.1
  Bottom 0.406: C11.2 54.43,45.67 C8.2 58.25,47.4 v58.38,47.5 | C11.2 53.53,45.69 C7.2 50.44,45.68 C9.2 | 5.23,12.52 5.23,16.95 C1.2 4.14,18 4.14,19.74 10.43,19.74 v11.28,20.59 | 5.23,12.52 5.18,12.58 R4.1 | U$1.P9-1 U$1.P9-2 | v59.61,36.97 59.61,36.9 X2.5 67.82,37.34 v70.01,38.67 | U$1.P8-2 U$1.P8-1 7.68,48.64 9.08,47.24 9.08,45.72 8.83,45.47 7.5,45.47 CAT24C256WI-GT3.7 8.65,45.39 9.21,44.66 9.7,43.42 C10.2 11.41,41.63 CAT24C256WI-GT3.4 12.7,42.93 14.16,42.93 v14.16,40.13 17.21,40.13 17.24,40.16 R11.1 | C5.2 37.89,32.4 C6.2 35.73,34.52 v35.75,34.54 | D6.2 48.84,21.45 48.58,21.71 | C5.2 48.58,21.71 | C5.2 42.24,28.04 IC2.5 35.39,17.89 | 35.39,17.89 IC8.8 32.45,16.69 32.35,16.59 C50.2 31.18,15.69 31.18,15.73 | 48.58,21.71 46.67,19.81 46.67,14.73 49.1,12.3 D7.1 49.1,8.64 v49.21,8.64 | IC8.2 37.86,15.42 35.39,17.89 | D29.ANODE 27.83,15.04 27.83,15.73 31.18,15.73 | v52.45,36.25 52.5,36.16 IC3.7 | v60.39,13.72 61.03,13.72 v61.03,8.74 U$1.P9-44 | U$1.P9-45 65.47,1.91 v65.47,5.59 | v59.63,21.34 67.5,21.34 v67.5,24.89 69.27,26.66 v69.27,28.31 | v42.86,29.97 42.1,29.97 42.1,28.19 C5.2 | R10.1 20.18,46.83 20.18,42.23 19.37,41.66 | R11.1 17.24,41.43 | R11.1 17.6,41.66 19.37,41.66 | 19.37,41.66 v27.65,41.47 | IC3.25 IC3.26 | 31.18,15.73 31.2,15.75 | C4.2 8.72,10.44 C3.2 5.23,11.54 5.23,12.52 | IC1.2 7.7,11.48 C4.2 | C4.2 12.79,10.45 D1.ANODE 13.6,9.68 v12.24,8.32 | v49.87,38.78 49.9,40.71 IC3.18 | C11.2 54.44,44.78 IC3.25 | IC3.21 51.93,39.21 v52.1,38.96 52.12,39.14 54.06,39.23 54.44,39.61 IC3.25
  pour Bottom (rank 3): 14.56,12.61 12.66,12.61 12.66,11.91 12.46,11.71 8.26,11.71 8.16,11.81 8.16,13.11 8.06,13.21 7.26,13.21 7.26,11.91 4.96,11.91 4.96,13.31 3.46,13.31 3.36,13.21 3.36,11.71 5.46,9.61 10.06,9.61 10.16,9.51 14.86,9.51 14.86,12.31
  pour Top (rank 6): -5,54.5 -5,39 10,39 10,21 -12,21 -12,6.5 arc90 -5.5,0 62.5,0 63,0 arc90 74.5,11.5 74.5,44 arc90 64,54.5 62,54.5
I2C2_SCA
  Bottom 0.406: U$1.P9-19 29.27,3.17 27.12,3.17 26.73,3.56 26.76,4.86 26.53,5.32 26.21,5.97 25.49,7.75 25.46,22.59 25.44,35.63 25.44,35.92 13.41,35.92 11.11,38.96 10.98,39.3 10.7,39.58 9.71,40.36 7.43,40.26 CAT24C256WI-GT3.5
  pour Bottom: 8.66,43.29 5.31,43.23 4.51,42.43 3.41,42.43 3.31,42.33 3.31,40.83 3.21,40.73 4.21,40.73 5.71,42.23 8.61,42.23
I2C2_SCL
  Bottom 0.406: CAT24C256WI-GT3.6 7.47,44.07 8.57,44.07 8.7,43.94 8.88,43.44 9.01,43.32 9.06,43.17 9.53,41.88 10.04,41.23 10.05,41.02 11.12,40.15 12.28,39.34 14.53,36.75 26.39,37.22 26.39,34.33 26.27,24.53 26.33,9.53 27.32,6.33 29.7,5.81 U$1.P9-20
  pour Bottom (rank 2): 8.71,44.63 4.71,44.63 4.71,44.83 4.61,44.93 3.51,44.93 3.21,44.63 3.21,43.53 3.31,43.43 8.71,43.43
LED1_G  (via drill 0.6)
  Top 0.406: X-518.3 32.9,32.05 40.56,32.05 40.57,32.04 41.29,32.04 44.11,34.86 v44.11,37.11
  Top 0.5: Q2.3 54.63,46.37 53,48 49.5,48 48.43,46.93 v44.19,46.93
  Bottom 0.406: v44.11,37.11 v44.19,46.93
LED1_G_FF  (via drill 0.38)
  Top 0.406: R1.2 62.42,45.71
  Top 0.5: R1.2 61.06,45.48 Q9.1 60.58,45 v59.5,45 | v47.15,48.8 19.8,48.8 19.15,49.45 19.15,50.6 18.35,51.4 16.61,51.4 U$1.P8-8
  Bottom 0.5: v59.5,45 59.5,48.5 59.2,48.8 v47.15,48.8
LED1_R
  Top 0.5: 59.77,41.5 Q3.3 59.42,41.85 45.7,41.85 42.5,45 41,45 37,41 37,34 36,33 31,33 31,31 32.04,29.96 X-518.2
LED1_R_FF
  Top 0.406: Q10.1 66.55,42.66 R12.2 68.57,42.63 68.76,42.61 68.76,45.55 67.88,46.29 66.84,46.32 66.23,48.01 65.46,50.15 64.14,51.47 57.44,51.47 57.37,51.4 57.35,51.42 19.6,51.42 18.32,52.7 U$1.P8-10
LED2_G
  Top 0.406: X-519.3 47.26,31.25 48.86,29.65 48.86,28.11 57.16,28.11 57.16,31.21 59,31.21
  Top 0.5: Q6.3 61.5,35.7 61.5,33 59.71,31.21 59,31.21
LED2_G_SW  (via drill 0.6)
  Top 0.406: R15.2 56.14,38.94 | R15.2 56.8,38.09 Q11.1 | R15.2 55.82,38.84 53.74,40.92 44.47,40.92 v41.85,43.54
  Bottom 0.406: v41.85,43.54 27.67,43.54 23.43,47.78 21.88,47.78 21.85,47.81 21.69,47.81 21.67,47.79 21.67,51.42 U$1.P8-12
LED2_R  (via drill 0.6)
  Top 0.406: X-519.2 v47.69,29.21
  Top 0.5: Q7.3 46.21,32.5 44.5,32.5 44,32 44,30.5 45.29,29.21 X-519.2
LED2_R_SW  (via drill 0.6)
  Top 0.406: v52.44,29.79 52.44,30.02 Q12.1 53.47,30.93 55.68,33.13 57.42,33.13 v57.44,33.15 | v59.62,33.18 59.62,35.26 R17.2
  Bottom 0.406: U$1.P8-14 22.92,53.16 23.58,54.01 44.56,54.01 44.56,49.76 42.94,48.14 42.94,32.57 47.92,27.59 50.24,27.59 v52.44,29.79 | v57.44,33.15 59.59,33.15 v59.62,33.18
N$1
  Bottom 0.406: D2.C 9.82,18 C1.1 6.75,17.76 IC1.4 IC1.5
N$4
  Top 0.406: R2.1 56.93,44.38 Q2.1 56.97,45.46
  Top 0.5: 56.97,45.46 57.8,45.46 Q9.3
N$5
  Bottom 0.406: IC1.1 10.29,12.6 C2.1
N$6
  pour Bottom (rank 2): 24.46,16.81 9.46,16.81 9.46,16.51 8.36,15.41 8.39,13.93 15.69,13.9 15.66,12.81 24.46,12.81
N$7  (via drill 0.38, 0.6)
  Top 0.406: v3.99,15.58 4.28,15.58 v6.07,13.54
  Bottom 0.406: R3.1 2.15,14.22 R4.2 | R4.2 4,14.28 | R4.2 4.11,15.46 v3.99,15.58 | v6.07,13.54 6.26,13.09 IC1.3
N$8
  Top 0.406: 60.55,37.99 Q6.1 60.66,38.18 | R16.1 60.74,39.73
  Top 0.5: Q11.3 59.06,39.77 R16.1 | 60.74,39.73 Q6.1
N$11  (via drill 0.6)
  Top 0.406: v51.72,46.63 51.72,44.34 v52.23,43.83
  Bottom 0.305: IC3.20 51.2,38.18 57.96,38.29 58.9,39.23 63.41,39.23 64.69,40.51 X2.1
  Bottom 0.406: C11.1 50.63,47.57 C7.1 50.97,47.39 v51.72,46.63 | v52.23,43.83 52.23,43.49 51.21,42.47 IC3.20 | X2.1 66.36,40.5
N$12
  pour Bottom (rank 5): 13.91,45.83 11.51,45.83 11.31,45.63 11.31,45.03 11.61,44.73 14.11,44.73 14.51,44.33 14.51,41.13 15.21,40.43 16.31,40.43 16.31,44.43 15.31,44.43
N$13
  Bottom 0.305: IC3.15 48.02,37.2 58.47,37.2 59.14,37.89 63.99,37.89 65,38.9 66.36,38.9 X2.3
N$14
  Bottom 0.305: IC3.16 48.59,37.69 58.17,37.69 58.17,37.71 58.99,38.53 63.75,38.53 64.82,39.6 66.27,39.6 X2.2
  Bottom 0.406: X2.2 66.31,39.64
N$15
  Bottom 0.406: C9.1 49.24,43.49 IC3.17
N$16
  pour Bottom (rank 4): 16.11,48.83 14.81,48.83 14.81,47.93 14.78,47.06 11.41,47.03 11.41,46.33 11.51,46.23 13.91,46.23 15.01,45.13 16.11,45.13
N$17
  Bottom 0.406: CAT24C256WI-GT3.3 12.55,44.2 10.1,44.2 10.1,46.85 R7.1
N$18
  Top 0.406: Q7.1 50.34,32.34 R18.1 52.01,32.05 Q12.3
N$19
  Bottom 0.406: D7.2 44.23,14.14 L6.3 42.07,14.79 37.32,14.79 36.59,15.42 IC8.7
N$21
  Top 0.406: R14.1 62.77,43.54 | Q3.1 62.61,43.45 R14.1 | R14.1 64.06,43.41 Q10.3
N$22  (via drill 0.6)
  Top 0.406: v35.75,14.48 35.75,17.78 v38.55,20.57
  Bottom 0.406: D6.1 44.38,19.58 L6.4 40.3,20.57 v38.55,20.57 | IC8.6 35.42,14.15 v35.75,14.48
N$23
  pour Bottom: 11.36,13.71 9.46,13.71 9.16,13.31 8.26,13.31 8.26,12.01 8.16,11.91 11.36,11.91
N$39
  Top 0.406: R38.2 62.6,12.98 SW2.1B
N$40
  Top 0.406: R43.1 62.01,14.33 SW2.2B
N$41
  pour Top: 57.86,8.42 56.56,8.42 56.53,18.1 57.83,18.1
N$56
  Bottom 0.406: IC8.4 37.2,12.88 35.79,11.55 31.1,11.55 30.04,12.45 R13.1
RXCAN  (via drill 0.6)
  Top 0.406: v31.18,13.73 31.29,9.63 34.97,9.63 v34.99,10.48
  Bottom 0.406: U$1.P9-24 37.02,3.25 39.31,3.25 39.4,3.36 39.3,9.82 39.34,11.79 37.21,11.86 35.96,10.61 v34.99,10.48 | D29.CATHODE 30.09,14.92 R13.2 31.29,14.68 v31.18,13.73
TXCAN  (via drill 0.6)
  Top 0.406: v37,9.72 v37,17.63
  Bottom 0.406: U$1.P9-26 37.66,4.45 36.94,5.06 36.85,9.61 v37,9.72 | v37,17.63 38.66,17.63 IC8.1
WAKE  (via drill 0.6)
  Top 0.406: R20.2 35.49,37.32 v33.73,37.32 R19.1 | U$1.P8-7 15.3,49.99 17.93,47.37 21.87,47.37 21.87,36.77 | 24.5,34 32.08,34 v32.65,34.57
  Top 0.5: 24.5,34 21.87,36.63 21.87,36.77
  Bottom 0.406: v32.65,34.57 33.73,35.65 v33.73,37.32 | U$1.P8-7 U$1.P8-9

### Text on the board
tPlace: X-520 | LCD POWER | SERIAL | X-519 | LED 2 | X-521 | 12V CONSTANT | X-518 | LED 1 | CAN | ON | CAN TERM
bPlace: SERIAL | CAN Cape v2.3.1 | Kim Concillado